# EAGLE design photodiode-opamp-tester-mk-1.0 (EAGLE 7.5.0)
AUTHOR: sean@yak.net
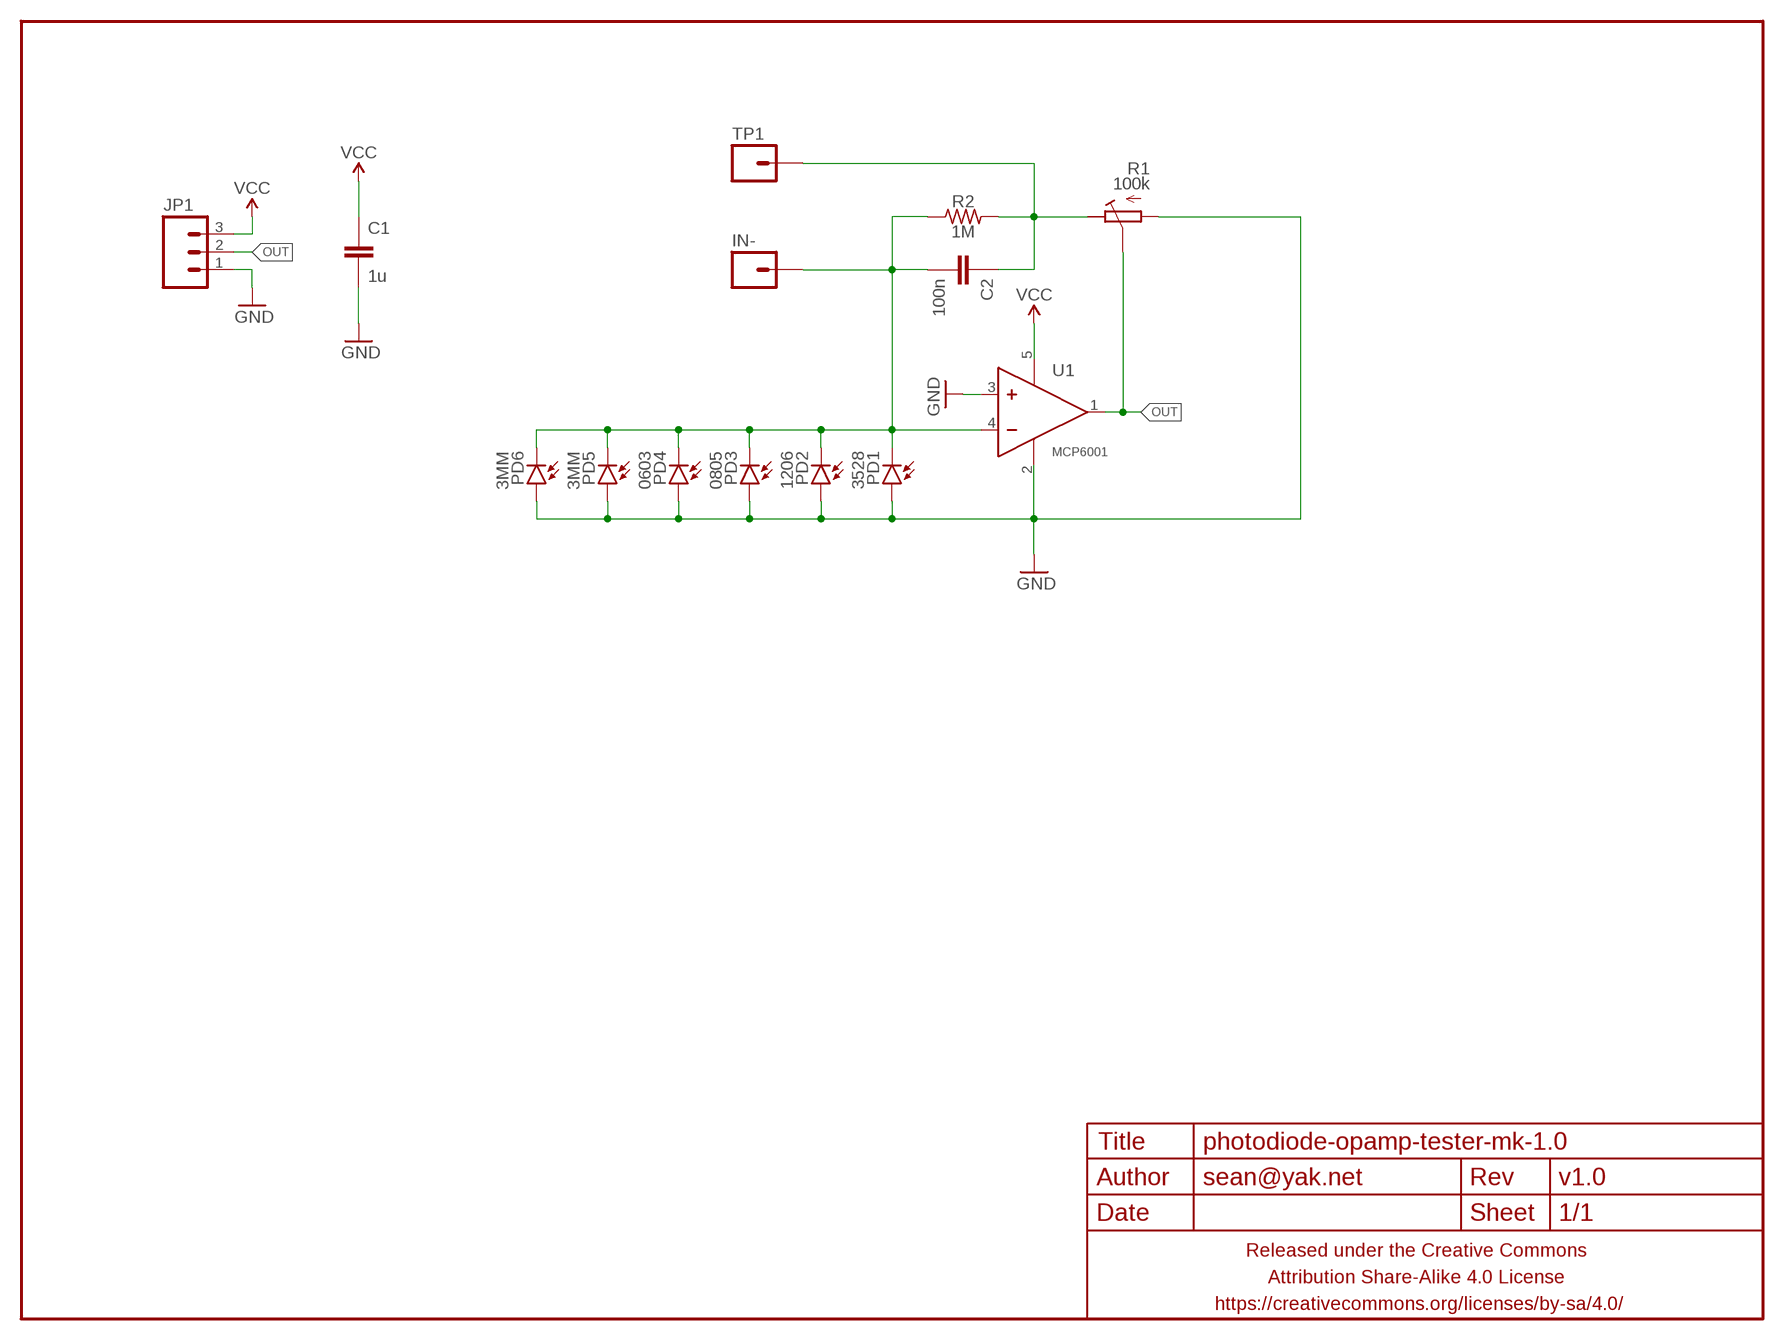
[diagram p0: schematic, sheet 1]

## Parts
C1  1u  CAPACITOR-CERAMICC0603  [C0603]
C2  100n  CAPACITOR-CERAMICC0603  [C0603]
FRAME1  FRAME-LETTERNO_PACKAGE  [DUMMY]
IN-  M01PTH  [1X01]
JP1  M03PTH-CENTERED  [1X03-CENTERED]
PD1  3528  PHOTODIODESMD-3528  [LED3528]
PD2  1206  PHOTODIODESMD-1206  [LED-1206]
PD3  0805  PHOTODIODESMD-0805  [LED-0805]
PD4  0603  PHOTODIODESMD-0603  [LED-0603]
PD5  3MM  PHOTODIODEPTH-3MM  [LED3MM-LESSSILK]
PD6  3MM  PHOTODIODEPTH-5MM  [LED5MM_SHORTPADS]
R1  100k  POTENTIOMETEREVM3Y  [EVM3Y]
R2  1M  RESISTORR0603  [R0603]
TP1  M01PTH  [1X01]
U1  MCP6001  MCP6001SOT23-5  [SOT23-5]

## Nets
GND: C1.2 JP1.1 PD1.A PD2.A PD3.A PD4.A PD5.A PD6.A R1.A U1.2(V-) U1.3(IN+)
N$2: C2.1 R1.E R2.2 TP1.1
N$3: C2.2 IN-.1 PD1.K(C) PD2.C PD3.C PD4.C PD5.K(C) PD6.K(C) R2.1 U1.4(IN-)
OUT: JP1.2 R1.S U1.1(OUT)
VCC: C1.1 JP1.3 U1.5(V+)

## Library data of the parts
C1 C2 = a_parts:CAPACITOR-CERAMIC: CAPACITOR, European symbol
FRAME1 = A_butts:FRAME-LETTER: Schematic Frame Standard 8.5x11 US Letter frame; DESIGNER: sean@yak.net; VERSION: v1.0
IN- TP1 = a_parts:M01: Header 1 Standard 1-pin 0.1" header. Use with straight break away headers (SKU : PRT-00116), right angle break away headers (PRT-00553), swiss pins (PRT-00743), machine pins (PRT-00117), and female headers (PRT-00115).
JP1 = a_parts:M03: Header 3 Standard 3-pin 0.1" header. Use with straight break away headers (SKU : PRT-00116), right angle break away headers (PRT-00553), swiss pins (PRT-00743), machine pins (PRT-00117), and female headers (PRT-00115). Molex polarized connector foot print use with SKU : PRT-08232 with associated crimp pins and housings.
PD1-PD6 = a_parts:PHOTODIODE
R1 = a_parts:POTENTIOMETER: Trimm resistor
R2 = a_parts:RESISTOR: RESISTOR, American symbol
U1 = a_parts:MCP6001

## Board
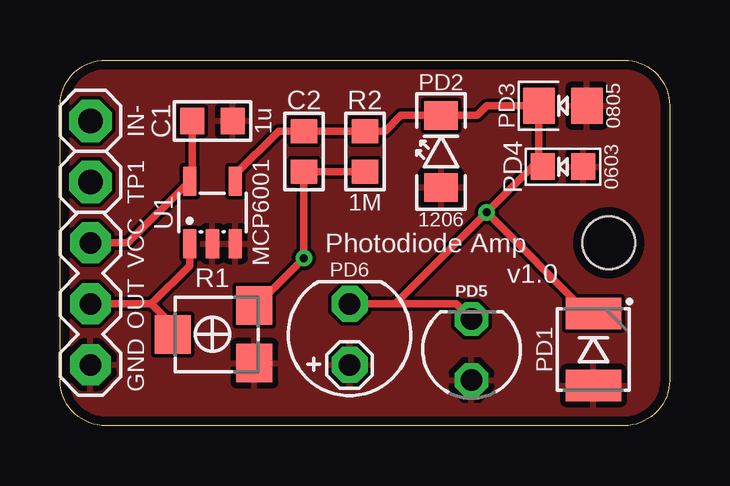
[diagram p1: board, top side]
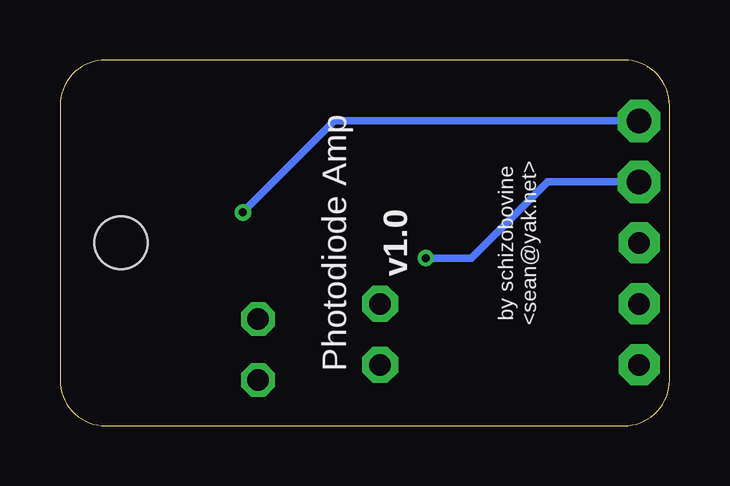
[diagram p2: board, bottom side, seen from below]

Size 25.4 x 15.24 mm. Coordinates in mm from the lower left corner, seen from the top.
Outline: 1.91,15.24 23.5,15.24 arc-90 25.4,13.34 25.4,1.91 arc-90 23.5,0 1.91,0 arc-90 0,1.91 0,13.34 arc-90 1.91,15.24
Copper layers (1*16): Top 0.0356mm / dielectric 1.5011mm / Bottom 0.0356mm
Design rules "LaenPCBOrder_2": minimum track width 6mil, minimum drill 13mil, track to track 6mil, track to pad 6mil, pad to pad 6mil, via to via 6mil, smd to smd 6mil, copper to edge 15mil, drill to drill 6mil, minimum pad ring 7mil, minimum via ring 7mil, stop-mask expansion 3mil, vias tented up to drill 20mil, thermal gap 10mil
Holes 2.2 mm at 22.86,7.62

### Footprints (pad centres in the part's own frame; a part is rotated, then mirrored left to right if it is on the bottom)
C0603 = smd 1 x 1.1: 1 -0.85,0; 2 0.85,0
1X01 = drill 1.016 pad 1.778 octagon: 1 0,0
1X03-CENTERED = drill 0.9 pad 1.7 octagon: 1 -2.54,0; 2 0,0; 3 2.54,0
LED3528 = smd 2.3 x 1.3: A 0,-1.5; K 0,1.5
LED-1206 = smd 1.2 x 1.4: A -1.5,0; C 1.5,0
LED-0805 = smd 1.5 x 1.3: A 0,-1; C 0,1
LED-0603 = smd 1.1 x 1: A 0,-0.85; C 0,0.85
LED3MM-LESSSILK = drill 0.9 pad 1.4 octagon: A -1.27,0; K 1.27,0
LED5MM_SHORTPADS = drill 0.9 pad 1.5 octagon: A -1.27,0; K 1.27,0
EVM3Y = smd 1.6 x 1.5: A -1.2,-1.75; E 1.2,-1.75; S 0,1.65
R0603 = smd 1 x 1.1: 1 -0.85,0; 2 0.85,0
SOT23-5 = smd 0.55 x 1.2: 1 -0.95,-1.3; 2 0,-1.3; 3 0.95,-1.3; 4 0.95,1.3; 5 -0.95,1.3

### Placement (x,y rotation side)
C1  6.35,12.7 0 top
C2  10.16,11.43 90 top
FRAME1  0,0 90 bottom
IN-  1.27,12.7 270 top
JP1  1.27,5.08 90 top
PD1  22.23,3.17 0 top
PD2  15.88,11.43 90 top
PD3  20.95,13.34 90 top
PD4  20.95,10.79 90 top
PD5  17.14,3.17 90 top
PD6  12.06,3.81 90 top
R1  6.35,3.81 90 top
R2  12.7,11.43 270 top
TP1  1.27,10.16 270 top
U1  6.35,8.89 0 top

### Tracks (layer width: path | path; a pad name or v marks a point on that pad's centre or on a via)
GND
  pour Top (rank 6): 1.91,15.24 23.5,15.24 arc-90 25.4,13.34 25.4,1.91 arc-90 23.5,0 1.91,0 arc-90 0,1.91 0,13.34 arc-90
N$2  (via drill 0.33)
  Top 0.305: R2.2 C2.1 v10.16,6.99 8.19,5.01 R1.E
  Bottom 0.305: v10.16,6.99 8.26,6.99 5.08,10.16 TP1.1
N$3  (via drill 0.33)
  Top 0.305: U1.4 7.3,10.47 9.11,12.28 C2.2 R2.1 13.55,12.28 14.2,12.93 PD2.C 17.38,12.93 17.78,13.34 PD3.C 19.95,10.95 PD4.C 19.68,10.79 v17.78,8.89 | PD6.K 13.97,5.08 | 13.97,5.08 v17.78,8.89 | PD5.K 16.51,5.08 13.97,5.08 | PD1.K 22,4.67 v17.78,8.89
  Bottom 0.305: IN-.1 13.97,12.7 v17.78,8.89
OUT
  Top 0.305: U1.1 5.4,6.67 3.81,5.08 | 3.81,5.08 JP1.2 | R1.S 4.7,4.19 3.81,5.08
VCC
  Top 0.305: JP1.3 2.83,7.62 U1.5 5.5,10.29 C1.1

### Text on the board
tPlace: VCC | Photodiode Amp | OUT | GND
bPlace: by schizobovine / <sean@yak.net> | Photodiode Amp